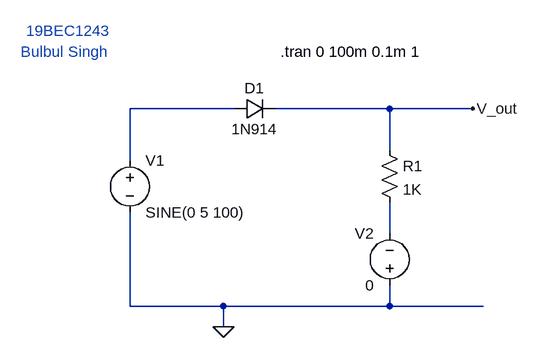
[diagram p0: schematic exp3_negative_clipper_task4.asc]
exp3_negative_clipper_task4.asc, the LTspice schematic file:
Version 4
SHEET 1 880 680
WIRE 160 48 0 48
WIRE 400 48 224 48
WIRE 528 48 400 48
WIRE 400 112 400 48
WIRE 0 128 0 48
WIRE 400 240 400 192
WIRE 0 352 0 208
WIRE 144 352 0 352
WIRE 400 352 400 320
WIRE 400 352 144 352
WIRE 544 352 400 352
WIRE 144 384 144 352
FLAG 144 384 0
FLAG 528 48 V_out
SYMBOL voltage 0 112 R0
WINDOW 123 0 0 Left 0
WINDOW 39 0 0 Left 0
SYMATTR InstName V1
SYMATTR Value SINE(0 5 100)
SYMBOL diode 160 64 R270
WINDOW 0 32 32 VTop 2
WINDOW 3 0 32 VBottom 2
SYMATTR InstName D1
SYMATTR Value 1N914
SYMBOL res 384 96 R0
SYMATTR InstName R1
SYMATTR Value 1K
SYMBOL voltage 400 336 R180
WINDOW 0 24 96 Left 2
WINDOW 3 24 16 Left 2
SYMATTR InstName V2
SYMATTR Value 0
TEXT -160 -72 Left 2 ;19BEC1243
TEXT -168 -40 Left 2 ;Bulbul Singh
TEXT 232 -40 Left 2 !.tran 0 100m 0.1m 1

The netlist it stands for:
* exp3_negative_clipper_task4.asc
V1 N001 0 SINE(0 5 100)
D1 N001 V_out 1N914
R1 V_out N002 1K
V2 0 N002 0
.model D D
.lib standard.dio
* 19BEC1243
* Bulbul Singh
.tran 0 100m 0.1m 1
.backanno
.end